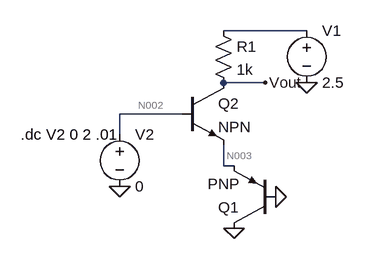
[diagram p0: schematic tut2 Q4.asc]
tut2 Q4.asc, the LTspice schematic file:
Version 4
SHEET 1 880 680
WIRE 192 -16 64 -16
WIRE 128 64 64 64
WIRE 0 112 -96 112
WIRE -96 144 -96 112
WIRE 64 192 64 160
WIRE 80 192 64 192
FLAG 144 240 0
FLAG 80 288 0
FLAG -96 224 0
FLAG 192 64 0
FLAG 128 64 Vout
SYMBOL res 48 -32 R0
SYMATTR InstName R1
SYMATTR Value 1k
SYMBOL pnp 144 288 R180
SYMATTR InstName Q1
SYMBOL npn 0 64 R0
SYMATTR InstName Q2
SYMBOL voltage 192 -32 R0
WINDOW 123 0 0 Left 2
WINDOW 39 0 0 Left 2
SYMATTR InstName V1
SYMATTR Value 2.5
SYMBOL voltage -96 128 R0
WINDOW 123 0 0 Left 2
WINDOW 39 0 0 Left 2
SYMATTR InstName V2
SYMATTR Value 0
TEXT -248 144 Left 2 !.dc V2 0 2 .01

The netlist it stands for:
* tut2 Q4.asc
R1 N001 Vout 1k
Q1 0 0 N003 0 PNP
Q2 Vout N002 N003 0 NPN
V1 N001 0 2.5
V2 N002 0 0
.model NPN NPN
.model PNP PNP
.lib standard.bjt
.dc V2 0 2 .01
.backanno
.end

* Results of the author's LTspice run, read from the files saved beside the schematic
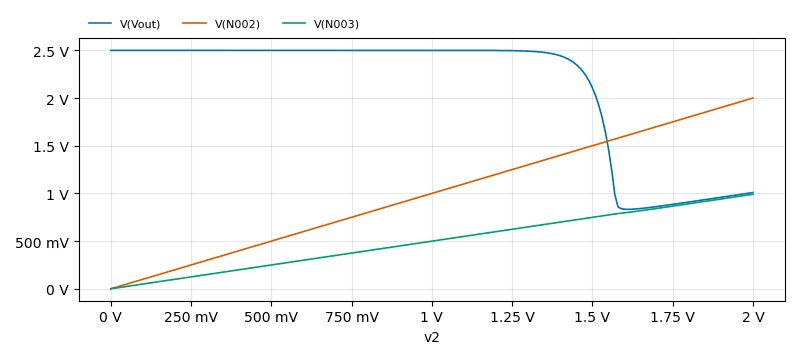
[diagram p1: DC transfer characteristic of tut2 Q4.asc, plotted from the saved traces]
* DC transfer characteristic, 1 run:
*   V(Vout): 2.5 V at v2=0 V, 1.009 V at v2=2 V, min 833.2 mV, max 2.5 V
*   V(N002): 0 V at v2=0 V, 2 V at v2=2 V, min 0 V, max 2 V
*   V(N003): 49.81 µV at v2=0 V, 991.2 mV at v2=2 V, min 49.81 µV, max 991.2 mV